# Altium schematic sheet ActionneursCapteurs.SchDoc
size A4
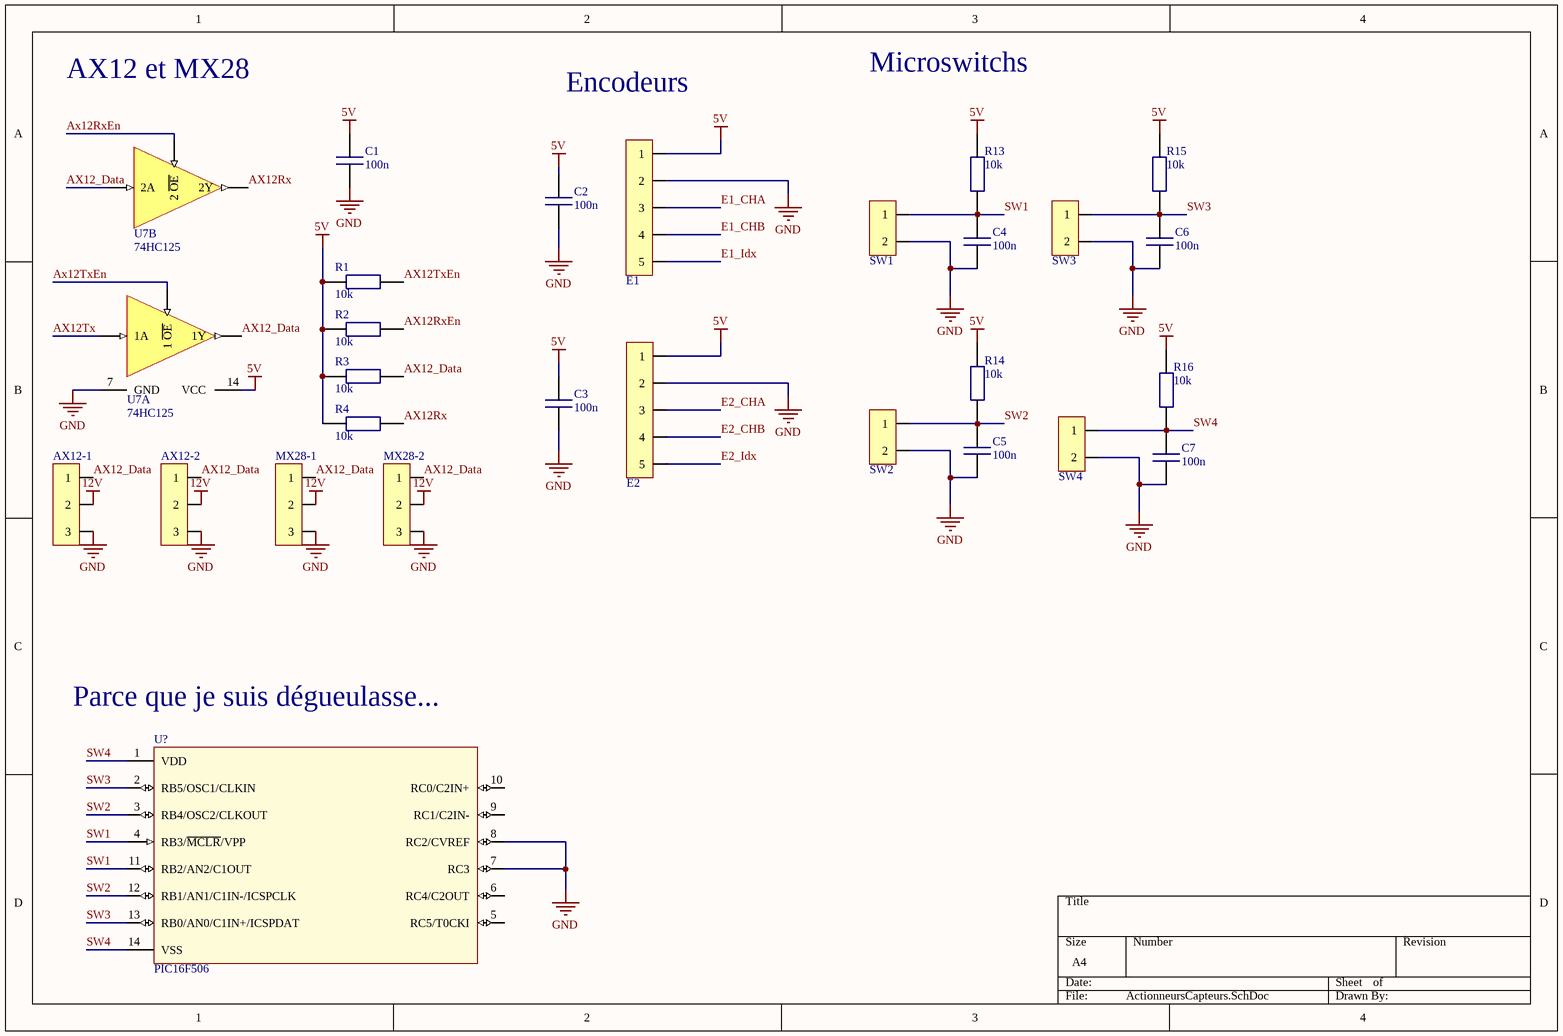
[diagram p0: ActionneursCapteurs.SchDoc]

## Parts
AX12-1  22-03-2031  [22-03-2031]  (value not drawn)
AX12-2  22-03-2031  [22-03-2031]  (value not drawn)
C1  100n  [C_2.54mm]
C2  100n  [C_2.54mm]
C3  100n  [C_2.54mm]
C4  100n  [C_2.54mm]
C5  100n  [C_2.54mm]
C6  100n  [C_2.54mm]
C7  100n  [C_2.54mm]
E1  22-03-2051  [22-03-2051]  (value not drawn)
E2  22-03-2051  [22-03-2051]  (value not drawn)
MX28-1  22-03-2031  [22-03-2031]  (value not drawn)
MX28-2  22-03-2031  [22-03-2031]  (value not drawn)
R1  10k  [R_250mW_trav]
R2  10k  [R_250mW_trav]
R3  10k  [R_250mW_trav]
R4  10k  [R_250mW_trav]
R13  10k  [R_250mW_trav]
R14  10k  [R_250mW_trav]
R15  10k  [R_250mW_trav]
R16  10k  [R_250mW_trav]
SW1  22-03-2021  [22-03-2021]  (value not drawn)
SW2  22-03-2021  [22-03-2021]  (value not drawn)
SW3  22-03-2021  [22-03-2021]  (value not drawn)
SW4  22-03-2021  [22-03-2021]  (value not drawn)
U7  74HC125  [DIP14]  (parts A,B of 4)
U?  PIC16F506  [DIP14]

## Nets
5V: C1.2 C2.2 C3.2 E1.1 E2.1 R1.2 R2.2 R3.2 R4.2 R13.1 R14.1 R15.1 R16.1 U7.14(VCC)
12V: AX12-1.2 AX12-2.2 MX28-1.2 MX28-2.2
GND: AX12-1.3 AX12-2.3 C1.1 C2.1 C3.1 C4.1 C5.1 C6.1 C7.1 E1.2 E2.2 MX28-1.3 MX28-2.3 SW1.2 SW2.2 SW3.2 SW4.2 U7.7(GND) U?.7(RC3) U?.8(RC2/CVREF)
AX12_Data: AX12-1.1 AX12-2.1 MX28-1.1 MX28-2.1 R3.1 U7.3(1Y) U7.5(2A)
AX12Rx: R4.1 U7.6(2Y)
AX12RxEn: R2.1 U7.4(2_~{OE})
AX12Tx: U7.2(1A)
AX12TxEn: R1.1 U7.1(1_~{OE})
E1_CHA: E1.3
E1_CHB: E1.4
E1_Idx: E1.5
E2_CHA: E2.3
E2_CHB: E2.4
E2_Idx: E2.5
SW1: C4.2 R13.2 SW1.1 U?.4(RB3/~{MCLR}/VPP) U?.11(RB2/AN2/C1OUT)
SW2: C5.2 R14.2 SW2.1 U?.3(RB4/OSC2/CLKOUT) U?.12(RB1/AN1/C1IN-/ICSPCLK)
SW3: C6.2 R15.2 SW3.1 U?.2(RB5/OSC1/CLKIN) U?.13(RB0/AN0/C1IN+/ICSPDAT)
SW4: C7.2 R16.2 SW4.1 U?.1(VDD) U?.14(VSS)

Not connected (* = marked no-connect by the designer): U? 5(RC5/T0CKI) 6(RC4/C2OUT) 9(RC1/C2IN-) 10(RC0/C2IN+)

## Notes on the sheet
- AX12 et MX28
- Encodeurs
- Microswitchs
- (near U?) Parce que je suis dégueulasse...

## Library data of the parts
AX12-1 AX12-2 MX28-1 MX28-2 = 22-03-2031: Manufacturer: MOLEX; Supplier 1: Farnell; Supplier Part Number 1: 9731083; Manufacturer Part Number: 22-03-2031; Pricing: 10=0.27, 100=0.242, 200=0.22, 500=0.208, 1000=0.202, 2500=0.196 (EUR); ComponentLink1URL: http://www.farnell.com/cad/1533907.pdf; ComponentLink1Description: http://www.farnell.com/cad/1533907.pdf; ComponentLink2URL: http://www.farnell.com/datasheets/1785732.pdf; ComponentLink2Description: http://www.farnell.com/datasheets/1785732.pdf
C1-C7 = C
E1 E2 = 22-03-2051: Manufacturer: MOLEX; Supplier 1: Farnell; Supplier Part Number 1: 9731105; Manufacturer Part Number: 22-03-2051; Pricing: 10=0.43, 100=0.35, 200=0.29, 500=0.26, 1000=0.24, 2500=0.191, 2500=0.172, 20000=0.155 (EUR); ComponentLink1URL: http://www.farnell.com/cad/1533907.pdf; ComponentLink1Description: http://www.farnell.com/cad/1533907.pdf; ComponentLink2URL: http://www.farnell.com/datasheets/1803075.pdf; ComponentLink2Description: http://www.farnell.com/datasheets/1803075.pdf
R1-R4 R13-R16 = R_trav
SW1-SW4 = 22-03-2021: Manufacturer: MOLEX; Supplier 1: Farnell; Supplier Part Number 1: 9731075; Manufacturer Part Number: 22-03-2021; Pricing: 10=0.189, 100=0.147, 200=0.119, 500=0.108, 1000=0.088, 2500=0.08, 2500=0.0711, 20000=0.064 (EUR); ComponentLink1URL: http://www.farnell.com/cad/1533907.pdf; ComponentLink1Description: http://www.farnell.com/cad/1533907.pdf; ComponentLink2URL: http://www.farnell.com/datasheets/1791308.pdf; ComponentLink2Description: http://www.farnell.com/datasheets/1791308.pdf
U7 = 74HC125N